# EAGLE design ai_blinkle_16 (EAGLE 7.1.0)
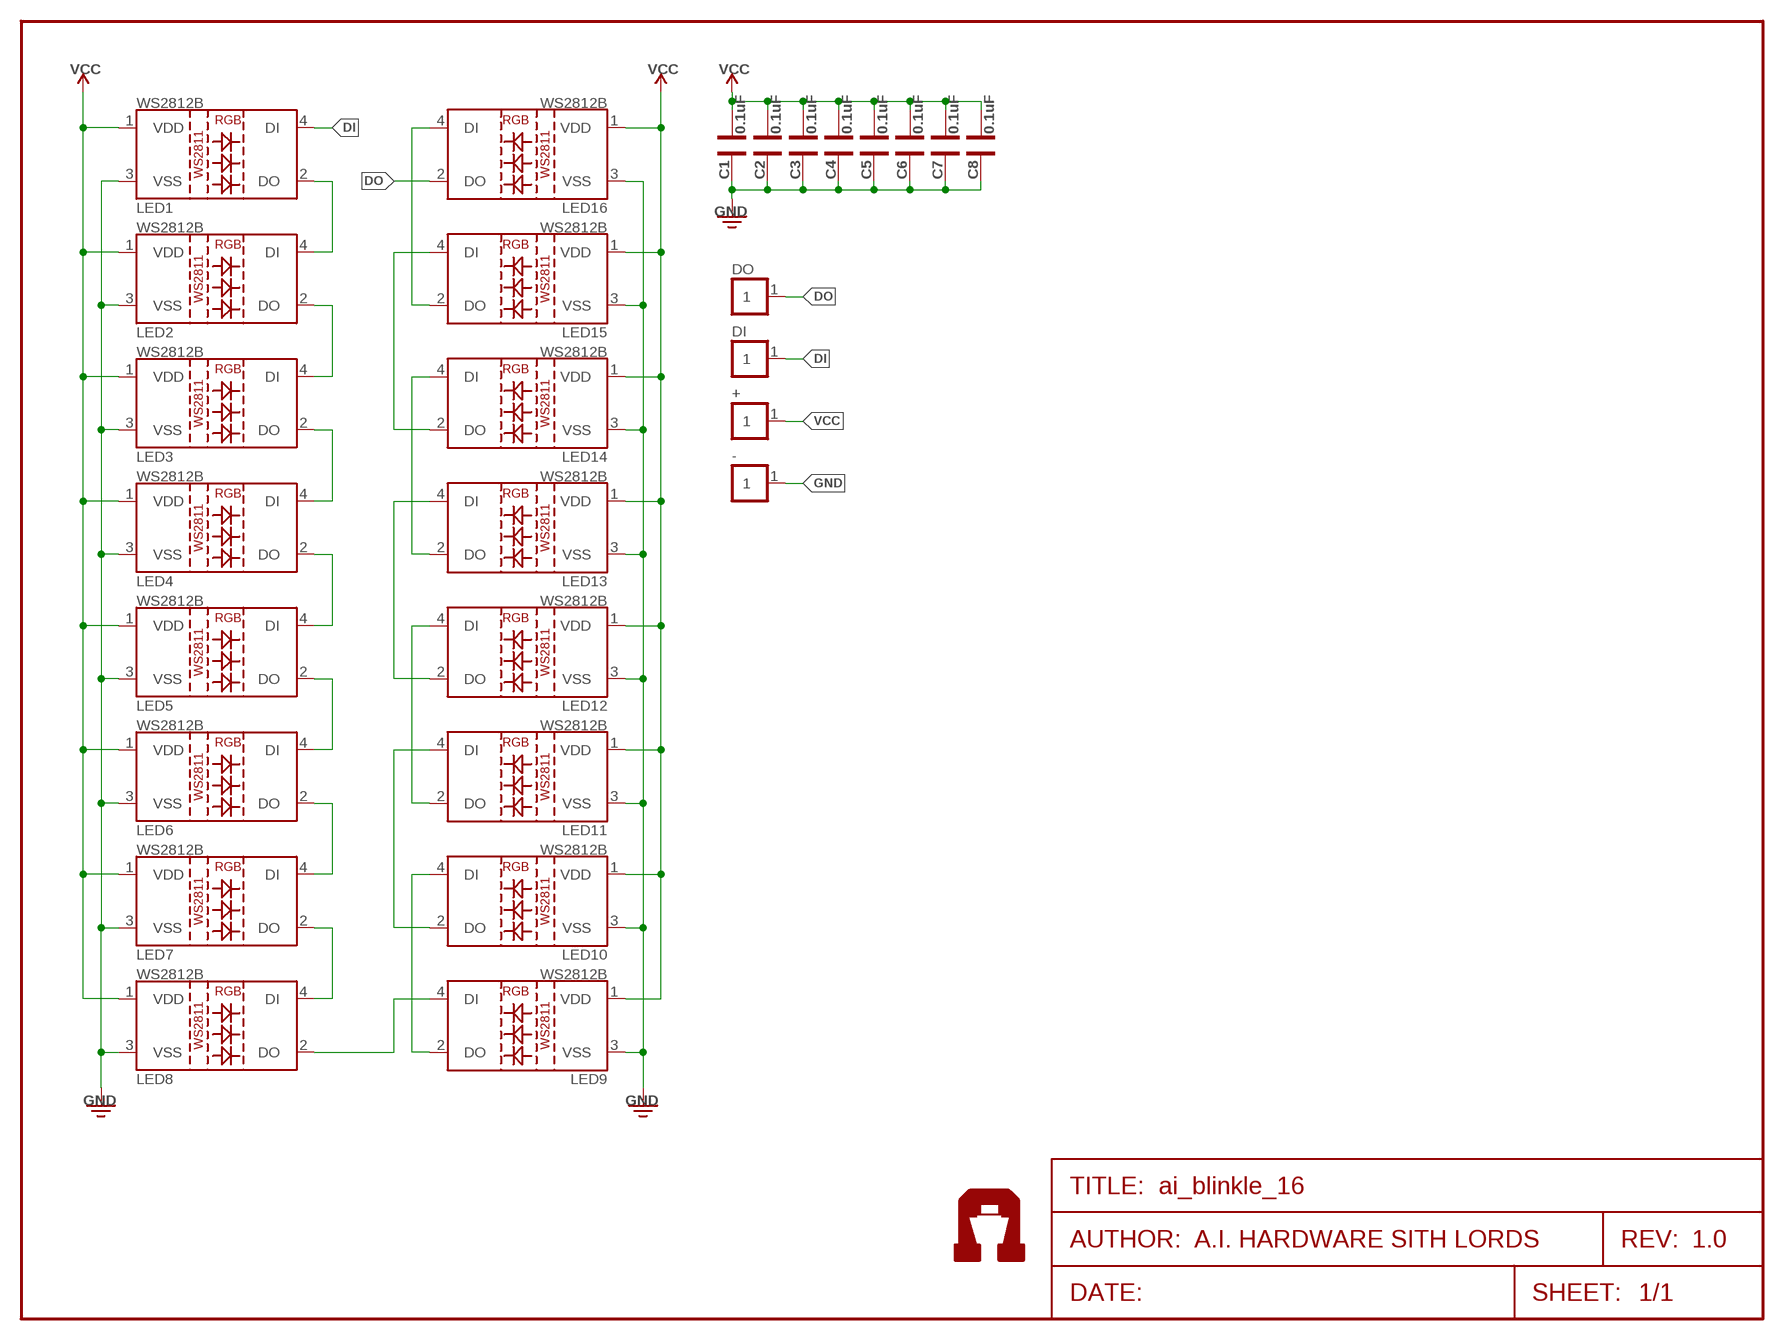
[diagram p0: schematic, sheet 1]
FRAME1 (FRAME-LETTER): AUTHOR: A.I. HARDWARE SITH LORDS; REV: 1.0

## Parts
+  1X01-SM  [1X01-SM]
-  1X01-SM  [1X01-SM]
C1  0.1uF  CAP0402  [CAP-0402]
C2  0.1uF  CAP0402  [CAP-0402]
C3  0.1uF  CAP0402  [CAP-0402]
C4  0.1uF  CAP0402  [CAP-0402]
C5  0.1uF  CAP0402  [CAP-0402]
C6  0.1uF  CAP0402  [CAP-0402]
C7  0.1uF  CAP0402  [CAP-0402]
C8  0.1uF  CAP0402  [CAP-0402]
DI  1X01-SM  [1X01-SM]
DO  1X01-SM  [1X01-SM]
LED1  LED-WS2812B-SM  [LED-WS2812B-SM]
LED2  LED-WS2812B-SM  [LED-WS2812B-SM]
LED3  LED-WS2812B-SM  [LED-WS2812B-SM]
LED4  LED-WS2812B-SM  [LED-WS2812B-SM]
LED5  LED-WS2812B-SM  [LED-WS2812B-SM]
LED6  LED-WS2812B-SM  [LED-WS2812B-SM]
LED7  LED-WS2812B-SM  [LED-WS2812B-SM]
LED8  LED-WS2812B-SM  [LED-WS2812B-SM]
LED9  LED-WS2812B-SM  [LED-WS2812B-SM]
LED10  LED-WS2812B-SM  [LED-WS2812B-SM]
LED11  LED-WS2812B-SM  [LED-WS2812B-SM]
LED12  LED-WS2812B-SM  [LED-WS2812B-SM]
LED13  LED-WS2812B-SM  [LED-WS2812B-SM]
LED14  LED-WS2812B-SM  [LED-WS2812B-SM]
LED15  LED-WS2812B-SM  [LED-WS2812B-SM]
LED16  LED-WS2812B-SM  [LED-WS2812B-SM]
LOGO  AI-LOGOXS  [AI-LOGO-XS]

## Nets
DI: DI.1 LED1.4(DI)
DO: DO.1 LED16.2(DO)
GND: -.1 C1.2 C2.2 C3.2 C4.2 C5.2 C6.2 C7.2 C8.2 LED1.3(VSS) LED2.3(VSS) LED3.3(VSS) LED4.3(VSS) LED5.3(VSS) LED6.3(VSS) LED7.3(VSS) LED8.3(VSS) LED9.3(VSS) LED10.3(VSS) LED11.3(VSS) LED12.3(VSS) LED13.3(VSS) LED14.3(VSS) LED15.3(VSS) LED16.3(VSS)
N$1: LED1.2(DO) LED2.4(DI)
N$2: LED2.2(DO) LED3.4(DI)
N$4: LED3.2(DO) LED4.4(DI)
N$5: LED4.2(DO) LED5.4(DI)
N$6: LED5.2(DO) LED6.4(DI)
N$7: LED6.2(DO) LED7.4(DI)
N$8: LED7.2(DO) LED8.4(DI)
N$9: LED8.2(DO) LED9.4(DI)
N$10: LED9.2(DO) LED10.4(DI)
N$11: LED10.2(DO) LED11.4(DI)
N$12: LED11.2(DO) LED12.4(DI)
N$13: LED12.2(DO) LED13.4(DI)
N$14: LED13.2(DO) LED14.4(DI)
N$15: LED14.2(DO) LED15.4(DI)
N$16: LED15.2(DO) LED16.4(DI)
VCC: +.1 C1.1 C2.1 C3.1 C4.1 C5.1 C6.1 C7.1 C8.1 LED1.1(VDD) LED2.1(VDD) LED3.1(VDD) LED4.1(VDD) LED5.1(VDD) LED6.1(VDD) LED7.1(VDD) LED8.1(VDD) LED9.1(VDD) LED10.1(VDD) LED11.1(VDD) LED12.1(VDD) LED13.1(VDD) LED14.1(VDD) LED15.1(VDD) LED16.1(VDD)

## Library data of the parts
+ - DI DO = Ai_Connectors:1X01
C1-C8 = Ai_Passives:CAP
LED1-LED16 = Ai_LED:LED-WS2812B
LOGO = Ai_Miscellany:AI-LOGO

## Board
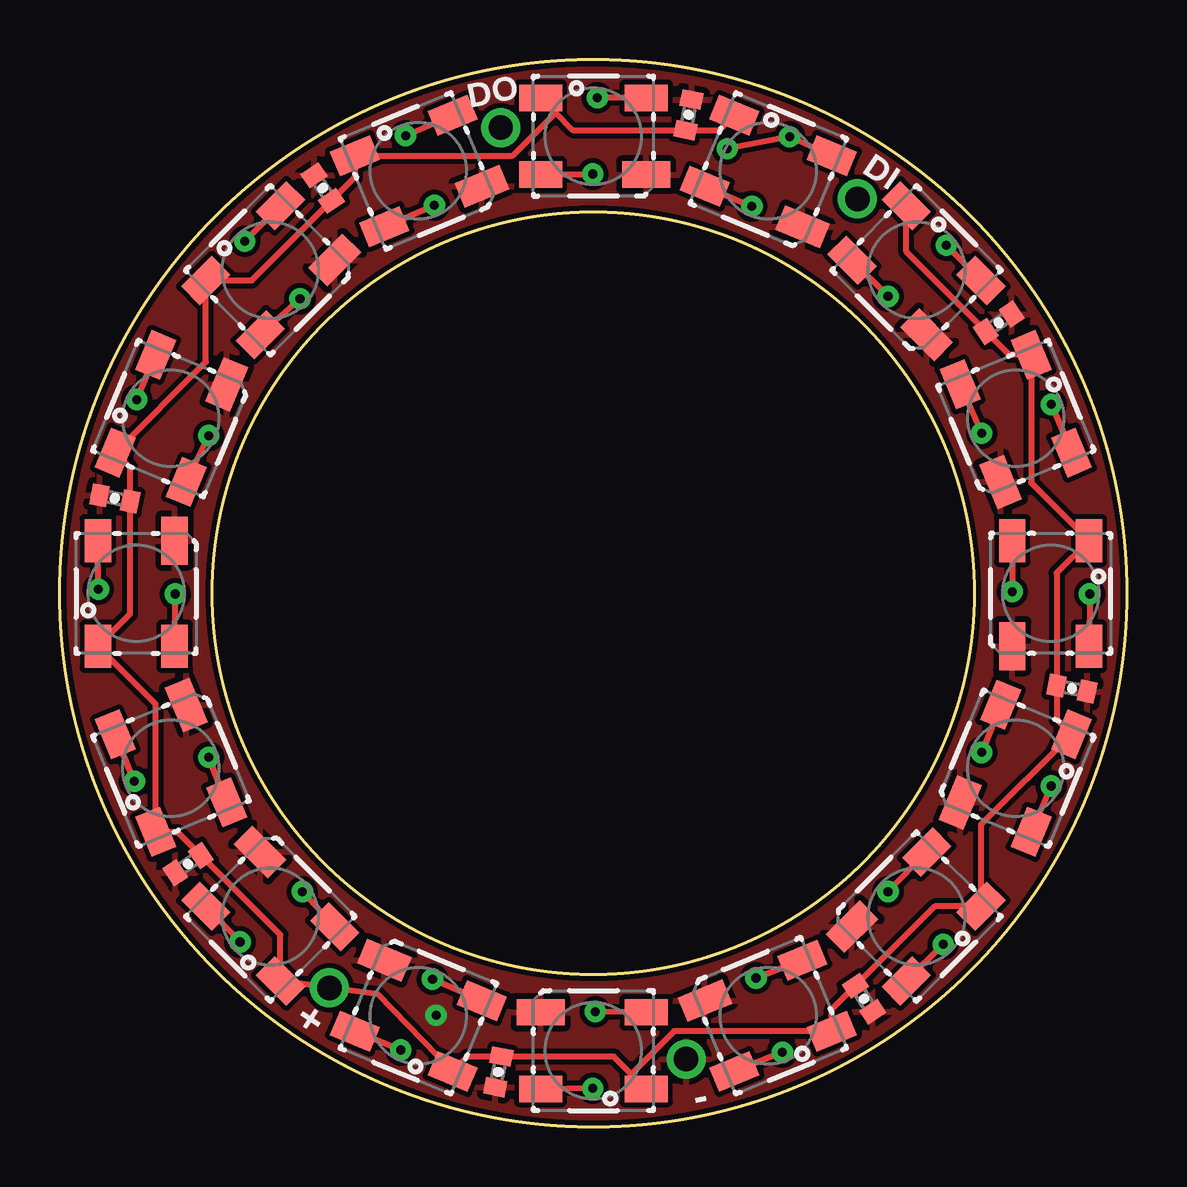
[diagram p1: board, top side]
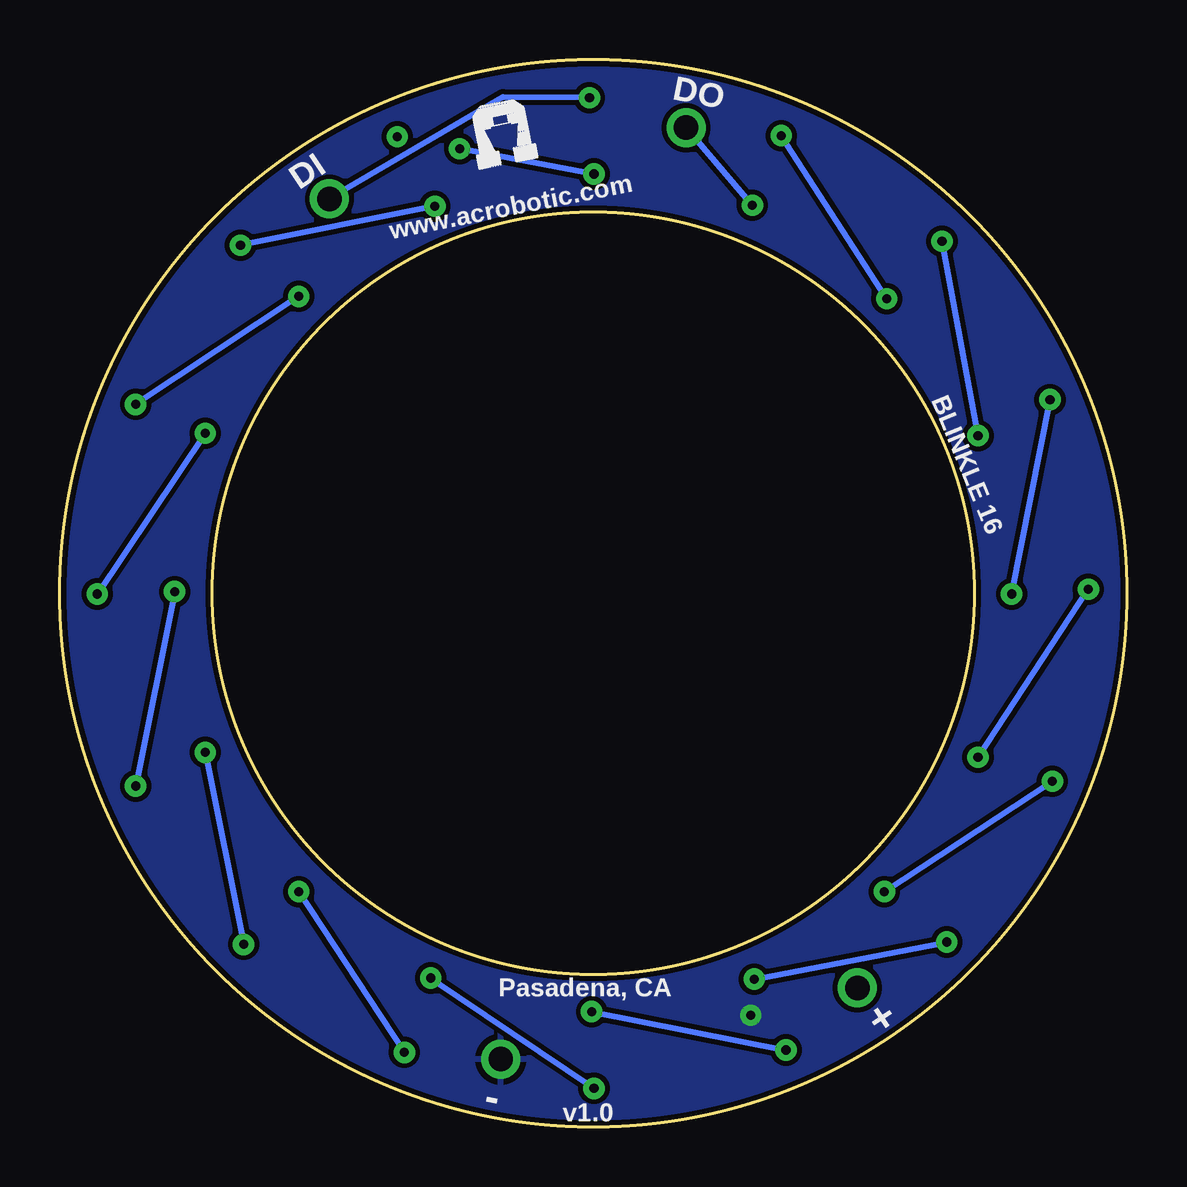
[diagram p2: board, bottom side, seen from below]

Size 44.45 x 44.45 mm. Coordinates in mm from the lower left corner, seen from the top.
Outline: circle at 22.23,22.23 radius 22.23
Outline: circle at 22.23,22.23 radius 15.88
Copper layers (1*16): Top 0.035mm / dielectric 1.5mm / Bottom 0.035mm
Design rules "ai_2layer": minimum track width 7mil, minimum drill 15mil, track to track 8mil, track to pad 8mil, pad to pad 8mil, via to via 8mil, smd to smd 8mil, copper to edge 8mil, drill to drill 8mil, minimum pad ring 12mil, minimum via ring 10mil, stop-mask expansion 4mil, vias tented up to drill 20mil, thermal gap 10mil

### Footprints (pad centres in the part's own frame; a part is rotated, then mirrored left to right if it is on the bottom)
1X01-SM = drill 1.016 pad 1.524: 1 0,0
CAP-0402 = smd 0.7 x 0.9: 1 -0.65,0; 2 0.65,0
LED-WS2812B-SM = smd 1.8 x 1.1: 1 -2.2,1.6; 2 -2.2,-1.6; 4 2.2,1.6 | smd 2 x 1.1: 3 2.2,-1.6

### Placement (x,y rotation side)
+  11.23,5.79 0 top
-  26.09,2.82 191.3 top
C1  26.19,42.16 78.8 top
C2  39.12,33.5 33.8 top
C3  42.16,18.26 348.8 top
C4  33.5,5.33 303.8 top
C5  18.26,2.29 258.8 top
C6  5.33,10.95 213.8 top
C7  2.29,26.19 168.8 top
C8  10.95,39.12 123.8 top
DI  33.22,38.66 0 top
DO  18.36,41.63 0 top
LED1  22.23,41.27 0 top
LED2  29.51,39.83 337.5 top
LED3  35.69,35.69 315 top
LED4  39.83,29.51 292.5 top
LED5  41.27,22.23 270 top
LED6  39.83,14.94 247.5 top
LED7  35.69,8.76 225 top
LED8  29.51,4.62 202.5 top
LED9  22.23,3.17 180 top
LED10  14.94,4.62 157.5 top
LED11  8.76,8.76 135 top
LED12  4.62,14.94 112.5 top
LED13  3.17,22.23 90 top
LED14  4.62,29.51 67.5 top
LED15  8.76,35.69 45 top
LED16  14.94,39.83 22.5 top
LOGO  27.05,39.8 11.2 bottom

### Tracks (layer width: path | path; a pad name or v marks a point on that pad's centre or on a via)
DI  (via drill 0.38)
  Top 0.254: LED1.4 v22.39,42.88
  Bottom 0.254: v22.39,42.88 26,42.9 DI.1
DO  (via drill 0.38)
  Top 0.254: LED16.2 v15.6,38.4
  Bottom 0.254: v15.6,38.4 DO.1
GND  (via drill 0.38)
  other vias: 15.67,4.65
  pour Top: 0,0 0,44.45 44.45,44.45 44.45,0
  pour Bottom: 0,0 0,44.45 44.45,44.45 44.45,0
N$1  (via drill 0.38)
  Top 0.254: LED1.2 20.05,39.7 v22.2,39.7 | LED2.4 v30.4,41.25 v27.8,40.75
  Bottom 0.254: v22.2,39.7 v27.8,40.75
N$2  (via drill 0.38)
  Top 0.254: LED2.2 v28.83,38.35 | v36.93,36.73 LED3.4
  Bottom 0.254: v28.83,38.35 v36.93,36.73
N$4  (via drill 0.38)
  Top 0.254: LED3.2 v34.5,34.6 | v41.3,30.1 LED4.4
  Bottom 0.254: v34.5,34.6 v41.3,30.1
N$5  (via drill 0.38)
  Top 0.254: LED4.2 v38.4,28.9 | v42.9,22.2 LED5.4
  Bottom 0.254: v38.4,28.9 v42.9,22.2
N$6  (via drill 0.38)
  Top 0.254: LED5.2 v39.67,22.3 | v41.3,14.2 LED6.4
  Bottom 0.254: v39.67,22.3 v41.3,14.2
N$7  (via drill 0.38)
  Top 0.254: LED6.2 v38.4,15.6 | v36.8,7.6 LED7.4
  Bottom 0.254: v38.4,15.6 v36.8,7.6
N$8  (via drill 0.38)
  Top 0.254: LED7.2 v34.5,9.8 | v30.1,3.1 LED8.4
  Bottom 0.254: v34.5,9.8 v30.1,3.1
N$9  (via drill 0.38)
  Top 0.254: LED8.2 v29,6.2 | v22.2,1.6 LED9.4
  Bottom 0.254: v29,6.2 v22.2,1.6
N$10  (via drill 0.38)
  Top 0.254: LED9.2 v22.3,4.8 | v14.2,3.2 LED10.4
  Bottom 0.254: v22.3,4.8 v14.2,3.2
N$11  (via drill 0.38)
  Top 0.254: LED10.2 v15.52,6.15 | v7.5,7.7 LED11.4
  Bottom 0.254: v15.52,6.15 v7.5,7.7
N$12  (via drill 0.38)
  Top 0.254: LED11.2 v10.1,9.8 | v3.1,14.4 LED12.4
  Bottom 0.254: v10.1,9.8 v3.1,14.4
N$13  (via drill 0.38)
  Top 0.254: LED12.2 v6.2,15.4 | v1.6,22.4 LED13.4
  Bottom 0.254: v6.2,15.4 v1.6,22.4
N$14  (via drill 0.38)
  Top 0.254: LED13.2 v4.8,22.2 | v3.2,30.3 LED14.4
  Bottom 0.254: v4.8,22.2 v3.2,30.3
N$15  (via drill 0.38)
  Top 0.254: LED14.2 v6.2,28.8 | v7.7,36.9 LED15.4
  Bottom 0.254: v6.2,28.8 v7.7,36.9
N$16  (via drill 0.38)
  Top 0.254: LED15.2 v10,34.5 | v14.4,41.3 LED16.4
  Bottom 0.254: v10,34.5 v14.4,41.3
VCC
  Top 0.254: LED2.1 27.47,41.53 C1.1 21.37,41.53 20.65,42.25 | LED1.1 20.65,42.25 | LED3.1 35.26,36.45 C2.1 39.56,32.16 LED4.1 40.46,26.84 LED5.1 41.53,23.08 C3.1 41.53,16.98 LED6.1 38.37,12.58 LED7.1 36.45,9.19 C4.1 32.16,4.89 LED8.1 25.59,3.99 23.8,2.2 | LED9.1 23.8,2.2 | 23.8,2.2 23.08,2.92 C5.1 16.98,2.92 LED10.1 13.23,5.53 +.1 LED11.1 9.19,8 C6.1 4.89,12.29 LED12.1 3.99,17.61 LED13.1 2.92,21.37 C7.1 2.92,27.47 LED14.1 6.08,31.87 LED15.1 8,35.26 C8.1 12.29,39.56 LED16.1 18.86,40.46 20.65,42.25

### Text on the board
bPlace: DO | DI | www.acrobotic.com | BLINKLE 16 | + | Pasadena, CA | - | v1.0